# Altium schematic sheet Sheet1.SchDoc
size A4
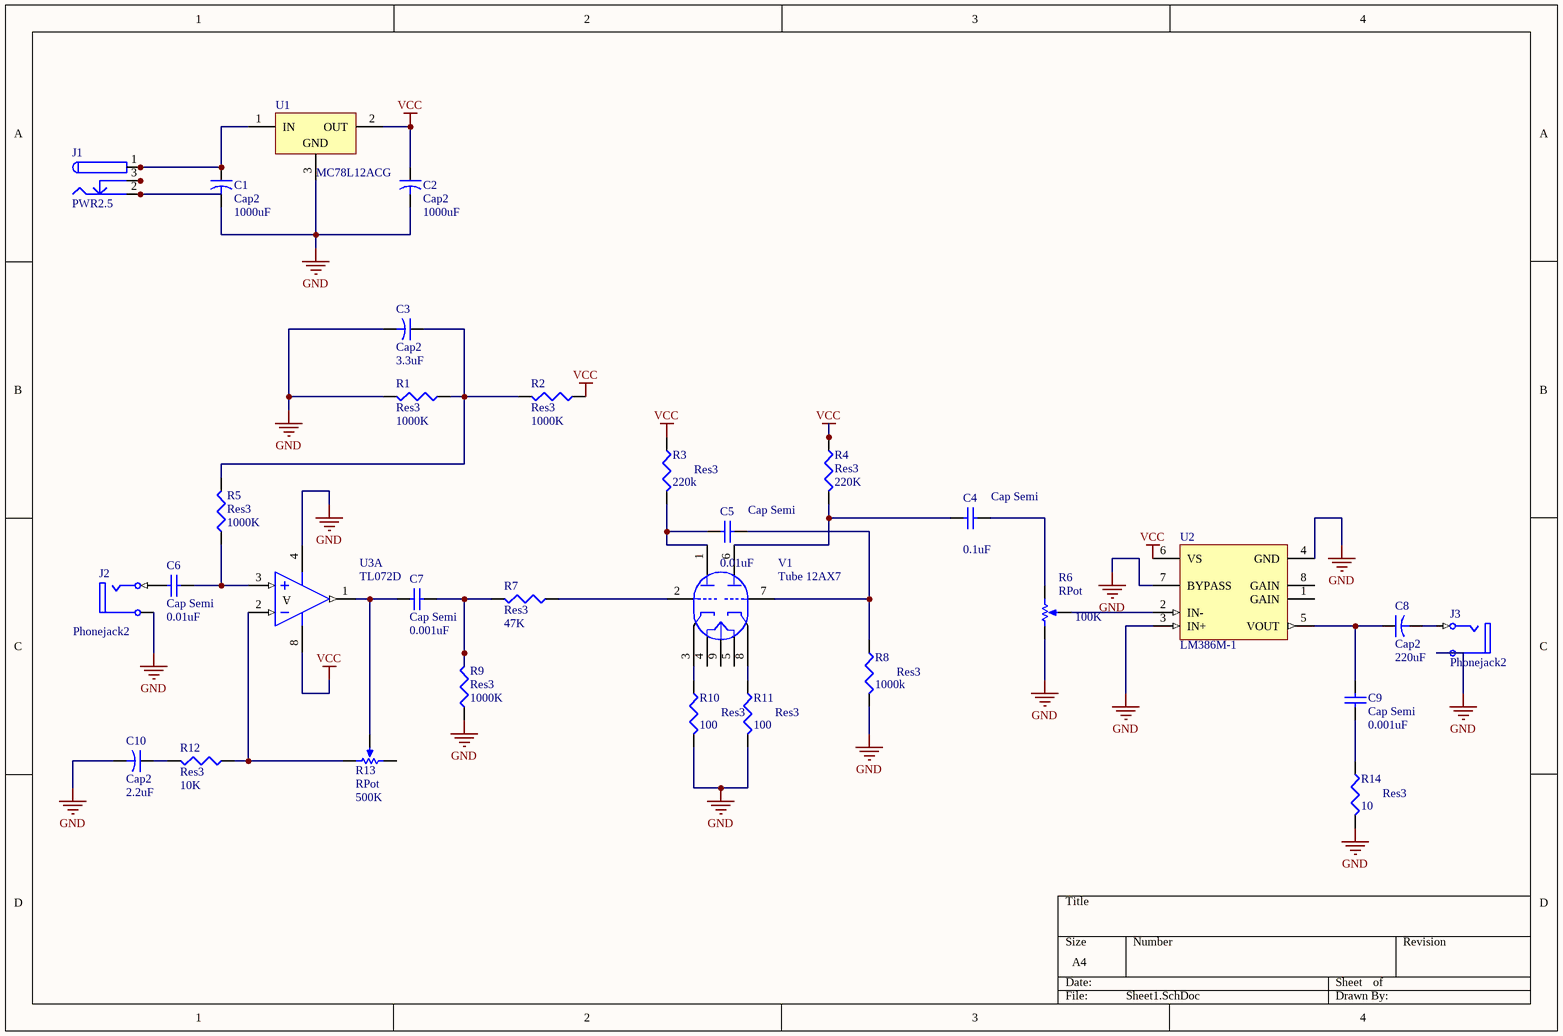
[diagram p0: Sheet1.SchDoc]

## Parts
C1  Cap2  value 1000uF  [CAPR5-4X5]
C2  Cap2  value 1000uF  [CAPR5-4X5]
C3  Cap2  value 3.3uF  [CAPR5-4X5]
C4  Cap Semi  value 0.1uF  [C1206]
C5  Cap Semi  value 0.01uF  [C1206]
C6  Cap Semi  value 0.01uF  [1608[0603]]
C7  Cap Semi  value 0.001uF  [C1206]
C8  Cap2  value 220uF  [CAPR5-4X5]
C9  Cap Semi  value 0.001uF  [C1206]
C10  Cap2  value 2.2uF  [CAPR5-4X5]
J1  PWR2.5  [KLD-0202]
J2  Phonejack2  [JACK/6-V2]
J3  Phonejack2  [JACK/6-V2]
R1  Res3  value 1000K  [J1-0603]
R2  Res3  value 1000K  [J1-0603]
R3  Res3  value 220k  [J1-0603]
R4  Res3  value 220K  [J1-0603]
R5  Res3  value 1000K  [J1-0603]
R6  RPot  value 100K  [VR5]
R7  Res3  value 47K  [J1-0603]
R8  Res3  value 1000k  [J1-0603]
R9  Res3  value 1000K  [J1-0603]
R10  Res3  value 100  [J1-0603]
R11  Res3  value 100  [J1-0603]
R12  Res3  value 10K  [J1-0603]
R13  RPot  value 500K  [VR5]
R14  Res3  value 10  [J1-0603]
U1  MC78L12ACG  [79-05]
U2  LM386M-1  [M08A_N]
U3  TL072D  [D008_M]  (part A of 2)
V1  Tube 12AX7  [VTUBE-9]

## Nets
GND: C1.2 C2.2 C3.2 C10.2 J2.5(S) J3.5(S) R1.2 R6.1(TOP) R8.2 R9.1 R10.2 R11.2 R14.2 U1.3(GND) U2.3(IN+) U2.4(GND) U2.7(BYPASS) U3.4(V-)
VCC: C2.1 R2.1 R3.1 R4.1 U1.2(OUT) U2.6(VS) U3.8(V+)
NetC1_1: C1.1 J1.1 J1.1A J1.1B U1.1(IN)
NetC3_1: C3.1 R1.1 R2.2 R5.2
NetC4_1: C4.1 R4.2 V1.6(PT2)
NetC4_2: C4.2 R6.2(BOT)
NetC5_1: C5.1 R3.2 V1.1(PT1)
NetC5_2: C5.2 R8.1 V1.7(GT2)
NetC6_1: C6.1 J2.1(T)
NetC6_2: C6.2 R5.1 U3.3(IN+)
NetC7_1: C7.1 R13.3(TAP) U3.1(OUT)
NetC7_2: C7.2 R7.2 R9.2
NetC8_1: C8.1 C9.2 U2.5(VOUT)
NetC8_2: C8.2 J3.1(T)
NetC9_1: C9.1 R14.1
NetC10_1: C10.1 R12.2
NetJ1_2: J1.2 J1.2A J1.2B
NetJ1_3: J1.3 J1.3A J1.3B
NetR6_3: R6.3(TAP) U2.2(IN-)
NetR7_1: R7.1 V1.2(GT1)
NetR10_1: R10.1 V1.3(KT1)
NetR11_1: R11.1 V1.8(KT2)
NetR12_1: R12.1 R13.2(BOT) U3.2(IN-)

Not connected (* = marked no-connect by the designer): R13 1(TOP); U2 1(GAIN) 8(GAIN); V1 4(H) 5(H) 9(HM)

## Notes on the sheet
- (in symbol TL072D, part A) A

## Library data of the parts
C1-C3 C8 C10 = Cap2: Capacitor; Published: 23-Sep-2002; PackageReference: CAPR5-4X5; Publisher: Altium Limited; PackageDescription: Capacitor; 2 Leads
C4-C7 C9 = Cap Semi: Capacitor (Semiconductor SIM Model); Published: 8-Jun-2000; LatestRevisionDate: 29-May-2009; LatestRevisionNote: IPC-7351 Footprint Added.; PackageReference: C1206; Publisher: Altium Limited; PackageDescription: Chip Capacitor
J1 = PWR2.5: Low Voltage Power Supply Connector; Published: 17-Dec-2003; DatasheetDocument: 09-May-2002; Publisher: Altium Limited; ComponentLink1Description: Manufacturer Link; ComponentLink1URL: http://domino.kycon.com/internet/Products.html
J2 J3 = Phonejack2: Jack Socket, 1/4" [6.5mm], Thru-Hole, Vertical, 2-Conductor Open Circuit; PackageDocument: 2003; PCB_Layout: Complies with manufacturer's recommendation.; DrillAndSlotSize: Corresponds to nominal value.; LatestRevisionDate: 15-Jul-2004; LatestRevisionNote: Component Replaced.; DatasheetDocument: 2003; PackageReference: S1VS_SNS; Publisher: Altium Limited; ComponentLink1Description: Manufacturer Link; ComponentLink1URL: http://www.cliffuk.co.uk/
R1-R5 R7-R12 R14 = Res3: Resistor; Published: 8-Jun-2000; LatestRevisionDate: 29-May-2009; LatestRevisionNote: IPC-7351 Footprint Added.; PackageReference: J1-0603; Publisher: Altium Limited; PackageDescription: Chip Resistor
R6 R13 = RPot: Potentiometer; Sim Note: Enter the Resistance value and the set point into parameter fields.; Set Position: 0.5; Published: 8-Jun-2000; LatestRevisionDate: 17-Jul-2002; LatestRevisionNote: Re-released for DXP Platform.; PackageReference: VR5; Publisher: Altium Limited; PackageDescription: Variable Resistor, Thru-Hole; 3 Leads
U1 = MC78L12ACG: 3-Terminal Low-Current Positive Fixed Voltage Regulator; Note: Case is electrically connected to pin 3.; Published: 17-Jul-2002; LatestRevisionDate: 28-Feb-2003; LatestRevisionNote: PCB Footprint, 'CAN-3/D9.3' replaced.; DatasheetVersion: 1988; PackageReference: 79-05; Publisher: Altium Limited; PackageDescription: Can; 3 Leads; Pin Circle Dia. 5.08 mm; Lead Dia. 0.53 mm (max); ComponentLink1Description: Manufacturer Link; ComponentLink1URL: http://www.onsemi.com/site/products/taxonomy/0,4438,503,00.html; ComponentLink2Description: Datasheet; ComponentLink2URL: http://www.onsemi.com/pub/Collateral/MC78L00A-D.PDF
U2 = LM386M-1: Low Voltage Audio Power Amplifier, 8-pin Narrow SOIC; Manufacturer: National Semiconductor; PackageTopMarking: NSZXTT*LM386*M-1; PowerWise: N; CompType: Audio IC; Published: 4-Dec-2008; DatasheetVersion: Aug-2000; PackageVersion: revM, May-2009; PackageReference: M08A; Publisher: Altium Limited; PackageDescription: SOIC Narrow, 4.9 x 3.9 x 1.45mm, 8 Lead, 1.27mm Pitch; Supplier 1: Farnell; Supplier Part Number 1: 9488324; PartNumber: LM386M-1; RoHS: N; PinCount: 8; Code_JEDEC: MS-012-AA; Code_IPC: SOIC127P600-8; ComponentLink1Description: LM386 Datasheet; ComponentLink1URL: http://www.national.com/ds/LM/LM386.pdf; ComponentLink2Description: LM386 Web Page; ComponentLink2URL: http://www.national.com/pf/LM/LM386.html; ComponentLink3Description: M08A Package Page; ComponentLink3URL: http://www.national.com/packaging/folders/m08a.html
U3 = TL072D: Low-Noise JFET-Input Operational Amplifier; Published: 16-Jan-2001; LatestRevisionDate: 13-Apr-2006; LatestRevisionNote: IPC-7351 Footprint Added.; DatasheetVersion: Aug-1996; PackageVersion: Jan-1998; PackageReference: D008; Publisher: Altium Limited; PackageDescription: 8-Pin Small Outline Integrated Circuit 1.27 mm Pitch; Code_IPC: SOIC127P600-8; ComponentLink1Description: Manufacturer Link; ComponentLink1URL: http://www.ti.com/; ComponentLink2Description: Datasheet; ComponentLink2URL: http://www-s.ti.com/sc/ds/tl072.pdf
V1 = Tube 12AX7: High Mu Dual Triode; Published: 8-Jun-2000; LatestRevisionDate: 17-Jul-2002; LatestRevisionNote: Re-released for DXP Platform.; PackageReference: VTUBE-9; Publisher: Altium Limited; PackageDescription: Vacuum Tube; 9 Leads